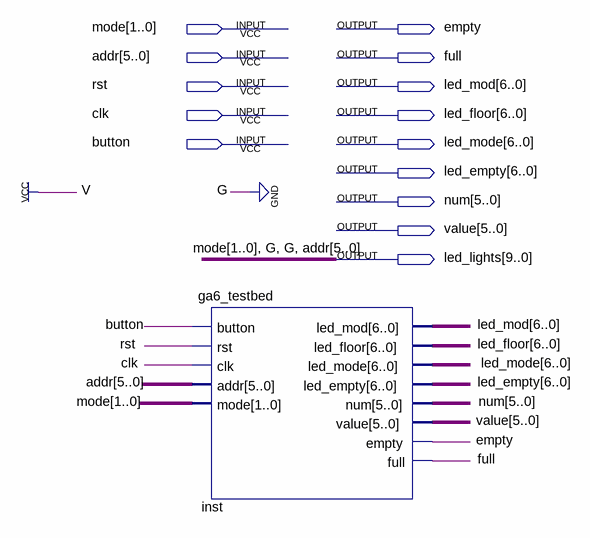
[diagram p0: schematic sheet]
// Quartus schematic gA6_lab3.bdf as structural Verilog: 1 symbols, 14 pins
module gA6_lab3 (
  input  [1:0] mode,
  input  [5:0] addr,
  input  rst,
  input  clk,
  input  button,
  output empty,
  output full,
  output [6:0] led_mod,
  output [6:0] led_floor,
  output [6:0] led_mode,
  output [6:0] led_empty,
  output [5:0] num,
  output [5:0] value,
  output [9:0] led_lights
);

  ga6_testbed inst (
    .button(button), .rst(rst), .clk(clk), .addr(addr), .mode(mode), .led_mod(led_mod),
    .led_floor(led_floor), .led_mode(led_mode), .led_empty(led_empty), .num(num), .value(value),
    .empty(empty), .full(full));

  assign led_lights = {mode, 2'b00, addr};
endmodule
